# Altium schematic sheet SD_Card.SchDoc
size A; SheetNumber: 10; SheetTotal: 10
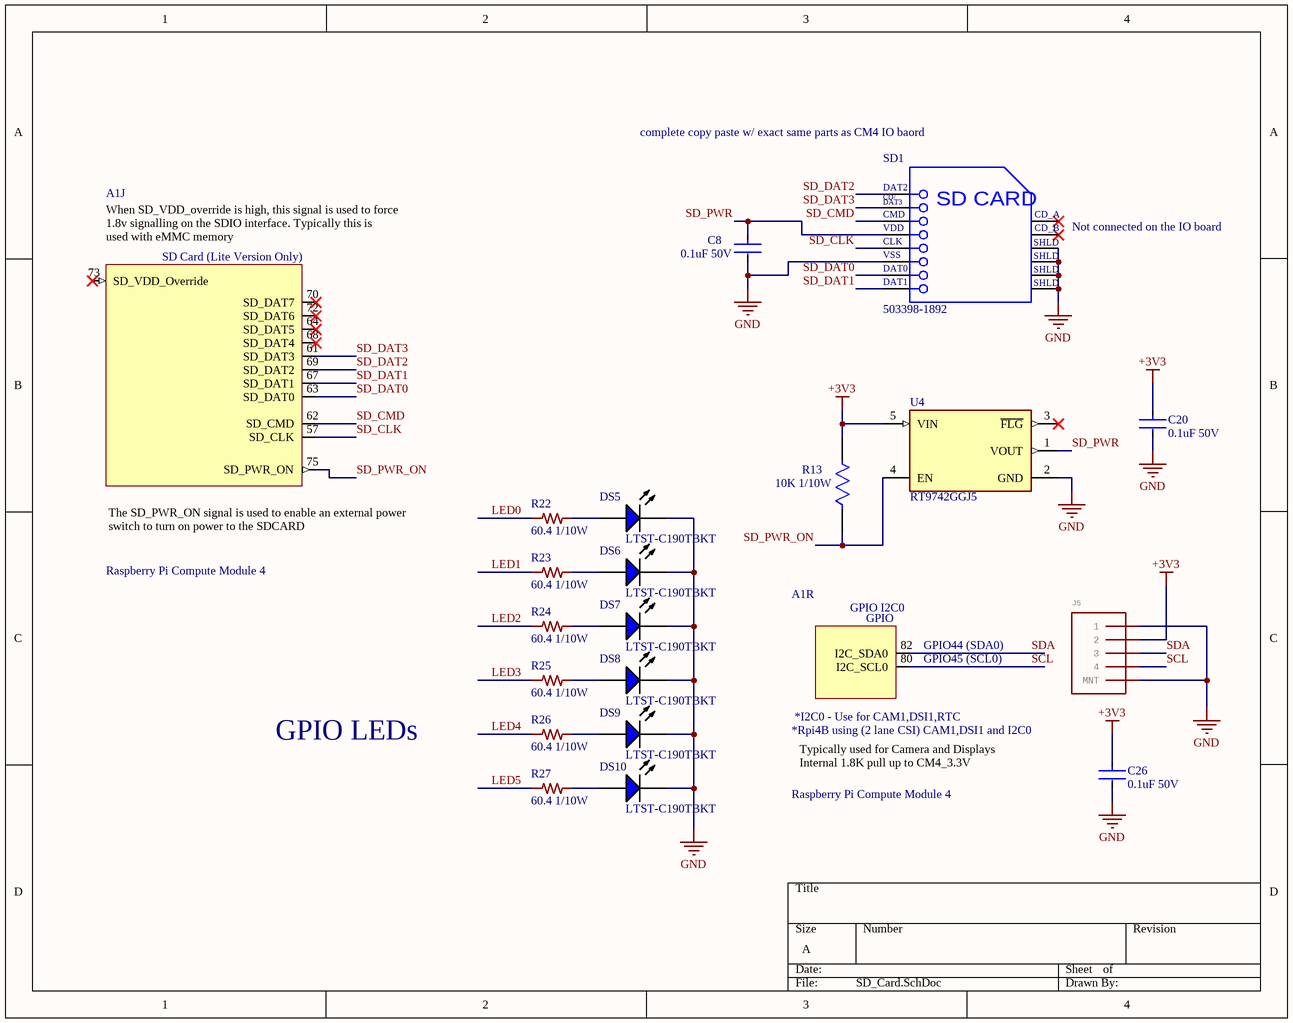
[diagram p0: SD_Card.SchDoc]

## Parts
A1  Raspberry Pi Compute Module 4  [CM4-F40C-100DS-0.4v_1.5mm_0mm]  (parts J,R of 21)  (no BOM)
C8  0.1uF 50V  [CAPACITOR_0603]
C20  0.1uF 50V  [CAPACITOR_0603]
C26  0.1uF 50V  [CAPACITOR_0603]
DS5  LTST-C190TBKT  [LTST-C190TBKT-2_V]
DS6  LTST-C190TBKT  [LTST-C190TBKT-2_V]
DS7  LTST-C190TBKT  [LTST-C190TBKT-2_V]
DS8  LTST-C190TBKT  [LTST-C190TBKT-2_V]
DS9  LTST-C190TBKT  [LTST-C190TBKT-2_V]
DS10  LTST-C190TBKT  [LTST-C190TBKT-2_V]
J5  4 Pin Connector  [JST_SM04B-SRSS-TB(LF)(SN)]  (value not drawn)
R13  10K 1/10W  [0603R]
R22  60.4 1/10W  [0603R]
R23  60.4 1/10W  [0603R]
R24  60.4 1/10W  [0603R]
R25  60.4 1/10W  [0603R]
R26  60.4 1/10W  [0603R]
R27  60.4 1/10W  [0603R]
SD1  503398-1892  [MOLX-503398-1892_V]
U4  RT9742GGJ5  [FP-RT9742GGJ5-IPC_C]

## Nets
+3V3: C20.2 C26.2 J5.2 R13.2 U4.5(VIN)
GND: C8.1 C20.1 C26.1 DS5.2(K) DS6.2(K) DS7.2(K) DS8.2(K) DS9.2(K) DS10.2(K) J5.0(MNT) J5.1 SD1.6(VSS) SD1.11(SHLD) SD1.12(SHLD) SD1.13(SHLD) SD1.14(SHLD) U4.2(GND)
LED0: R22.1
LED1: R23.1
LED2: R24.1
LED3: R25.1
LED4: R26.1
LED5: R27.1
SCL: A1.80(I2C_SCL0) J5.4
SD_CLK: A1.57(SD_CLK) SD1.5(CLK)
SD_CMD: A1.62(SD_CMD) SD1.3(CMD)
SD_DAT0: A1.63(SD_DAT0) SD1.7(DAT0)
SD_DAT1: A1.67(SD_DAT1) SD1.8(DAT1)
SD_DAT2: A1.69(SD_DAT2) SD1.1(DAT2)
SD_DAT3: A1.61(SD_DAT3) SD1.2(CD/DAT3)
SD_PWR: C8.2 SD1.4(VDD) U4.1(VOUT)
SD_PWR_ON: A1.75(SD_PWR_ON) R13.1 U4.4(EN)
SDA: A1.82(I2C_SDA0) J5.3
NetDS5_1: DS5.1(A) R22.2
NetDS6_1: DS6.1(A) R23.2
NetDS7_1: DS7.1(A) R24.2
NetDS8_1: DS8.1(A) R25.2
NetDS9_1: DS9.1(A) R26.2
NetDS10_1: DS10.1(A) R27.2

Not connected (* = marked no-connect by the designer): A1 64(SD_DAT5)* 68(SD_DAT4)* 70(SD_DAT7)* 72(SD_DAT6)* 73(SD_VDD_Override)*; SD1 9(CD_A)* 10(CD_B)*; U4 3(~{FLG})*

## Notes on the sheet
- complete copy paste w/ exact same parts as CM4 IO baord
- (near SD1) Not connected on the IO board
- GPIO LEDs
- (in symbol 503398-1892) CD/; DAT3; SD CARD
- (in symbol CM4, part J) When SD_VDD_override is high, this signal is used to force 1.8v signalling on the SDIO interface. Typically this is / used with eMMC memory; SD Card (Lite Version Only); by Amornthep Phunsin; The SD_PWR_ON signal is used to enable an external power switch to turn on power to the SDCARD
- (in symbol CM4, part R) GPIO I2C0; GPIO; GPIO44 (SDA0); GPIO45 (SCL0); *I2C0 - Use for CAM1,DSI1,RTC; *Rpi4B using (2 lane CSI) CAM1,DSI1 and I2C0; Typically used for Camera and Displays Internal 1.8K pull up to CM4_3.3V

## Library data of the parts
A1 = CM4: Raspberry Pi Compute Module 4 by Amornthep Phunsin; MPN: -
C8 C20 C26 = CL10B104KB8NNWC: CAP CER 0.1UF 50V X7R 0603; MFR: Samsung Electro-Mechanics; MPN: CL10B104KB8NNWC
DS5-DS10 = LTST-C190TBKT: LED Uni-Color Blue, 76 mW, 20 mA, -20 to 80 degC, 2-Pin SMD, RoHS, Tape and Reel; MFR: Lite-On; Forward Voltage: 2.8V; Lens Style: Diffused; Luminous Intensity: 28mcd; Forward Current: 20mA; Viewing Angle: 130degrees; Nominal Vf: 3.3V; Packaging: TapeandReel; Min Operating Temperature: -20°C; Illumination Colour: Blue; Package Quantity: 3000; Pins: 2; Mounting Technology: SM; Package Reference: C190TBKT-2; Package Description: 2-Pin Surface Mount Device, Body 1.6 x 0.8 mm; RoHS Compliant: True; Datasheet URL: http://optoelectronics.liteon.com/upload/download/DS-22-99-0224/S_110_LTST-C190TBKT(0630).pdf; Datasheet Version: Rev. K, 08/2011; Manufacturer URL: http://www.us.liteon.com/; Colour: Blue; Case/Package: 0603; Max Operating Temperature: 80°C; MPN: LTST-C190TBKT
J5 = CONNECTOR-4_?_*JST_SR_R/A: CONN HEADER SMD R/A 4POS 1MM; MANUFACTURER: JST; MPN: SM04B-SRSS-TB; GateName_1: G$1; SymbolName_1: CONNECTOR_04; DeviceName: JST_SR; LibraryName: HyTechDevices; DeviceSetName: CONNECTOR-4_?_*; MFR: JST
R13 = ERJ-3EKF1002V: RES SMD 10K OHM 1% 1/10W 0603; MFR: Parasonic; MFR PN: ERJ-3EKF1002V; MPN: ERJ-3EKF1002V
R22-R27 = RMCF0603FT60R4: RES SMD 60.4 OHM 1% 1/10W 0603; MANUFACTURER: Stackpole Electronics Inc; GateName_1: G$1; SymbolName_1: RESISTOR; DeviceName: 0603; DPKN: *; MPN: RMCF0603FT60R4; POWER: *; VOLTAGE_CONTINUOUS: *; VOLTAGE_MAX: *; RESISTANCE: *; MFR: Stackpole Electronics Inc
SD1 = 503398-1892: Micro SD Connector, Pitch 1.1 mm, 8 Position, Height 1.4 mm, -25 to 85 degC, RoHS, Tape and Reel; MFR: Molex; Voltage Rating: 10VAC/DC; Current Rating: 500mA; Manufacturer URL: http://www.molex.com/; MPN: 503398-1892; Packaging: Reel; RoHS: Details; Datasheet URL: http://www.molex.com/pdm_docs/sd/5033981892_sd.pdf; Mounting Technology: SurfaceMount; Factory Pack Quantity: 2400; Datasheet Version: Rev. E, 04/2006; Series: 503398; Product Category: MemoryCardConnectors; Package Description: Micro SD Connector, Pitch 1.1 mm, 8 Position, Height 1.4 mm
U4 = CMP-79883-000001-1: IC PWR SWTCH N-CHAN 1:1 TSOT23-5; MFR: Richtek USA Inc.; Interface: On/Off; Fault Protection: Over Temperature; Max Output Current: 1A; Number of Outputs: 1; Output Configuration: High Side; On-State Resistance: 70mR; REACH SVHC: No SVHC; Number of Pins: 23; Packaging: Tape and Reel; Case/Package: SOT-23-5; RoHS Compliant: Yes; Max Operating Temperature: 85°C; Min Operating Temperature: -40°C; MPN: RT9742GGJ5